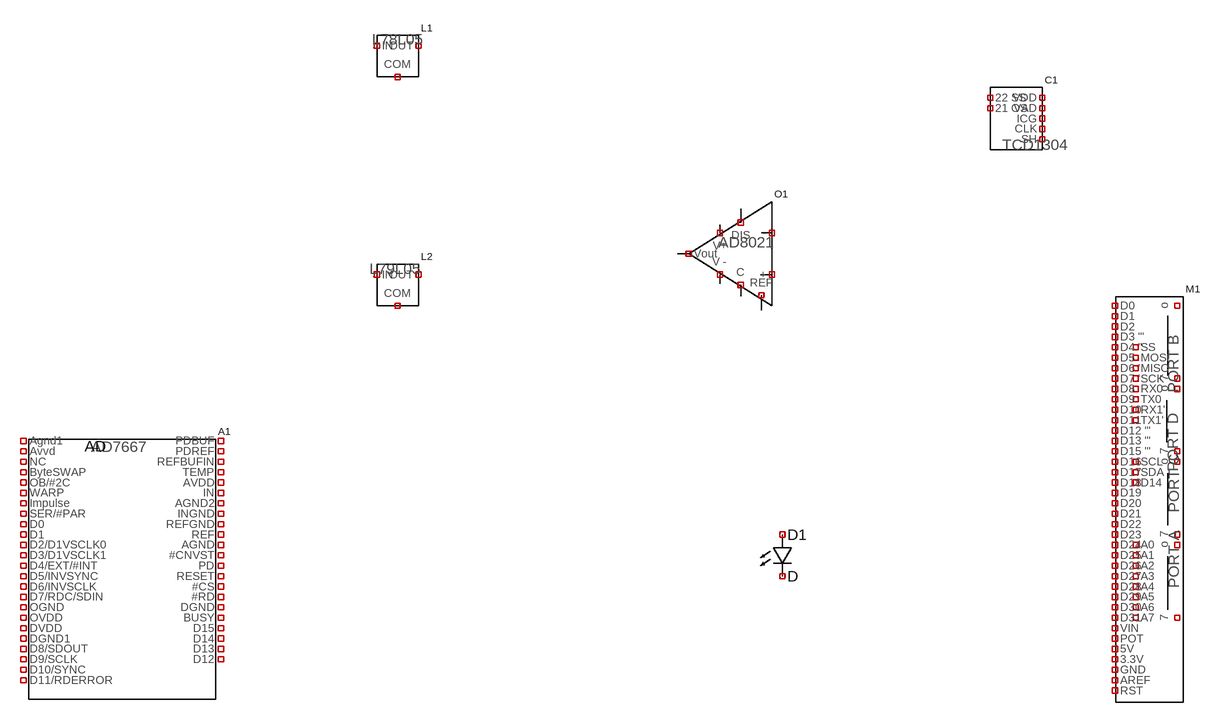
[diagram p0: schematic CCD driver FEB 25 sch2.asc]
CCD driver FEB 25 sch2.asc, the LTspice schematic file:
Version 4
SHEET 1 1036 724
SYMBOL AD8021 368 0 R0
SYMATTR InstName O1
SYMBOL TCD1304AP 784 -192 R0
SYMATTR InstName C1
SYMBOL AD7667 -608 464 R0
SYMATTR InstName A1
SYMBOL Atmega1284P\ Devlpmnt\ Brd1 992 240 R0
SYMATTR InstName M1
SYMBOL L78L05 -176 -304 R0
SYMATTR InstName L1
SYMBOL L79L05 -176 48 R0
SYMATTR InstName L2
SYMBOL LED 400 432 R0
SYMATTR InstName D1

The netlist it stands for:
* CCD driver FEB 25 sch2.asc
A§O1 0 0 0 0 0 0 0 0 opamp
C1 NC_01 NC_02 NC_03 NC_04 NC_05 NC_06 NC_07 IS
A1 0 0 0 0 0 0 0 0 AD AD7667
M1 NC_08 NC_09 NC_10 NC_11 NC_12 NC_13 NC_14 NC_15 NC_16 NC_17 NC_18 NC_19 NC_20 NC_21 NC_22 NC_23 NC_24 NC_25 NC_26 NC_27 NC_28 NC_29 NC_30 NC_31 NC_32 NC_33 NC_34 NC_35 NC_36 NC_37 NC_38 NC_39 NC_40 NC_41 NC_42 NC_43 NC_44 NC_45 NC_46 NC_47 NC_48 NC_49 NC_50 NC_51 NC_52 NC_53 NC_54 NC_55 NC_56 NC_57 NC_58 NC_59 NC_60 NC_61 NC_62 NC_63 NC_64 NC_65 NC_66 NC_67 NC_68 NC_69 NC_70 NC_71 NC_72 AVR ATmega1284P
L1 NC_73 NC_74 NC_75 L78L05
L2 NC_76 NC_77 NC_78 L79L05
D1 NC_79 NC_80 D
.model D D
.lib standard.dio
.model NMOS NMOS
.model PMOS PMOS
.lib standard.mos
.backanno
.end